# Altium schematic sheet 全联供输出板_V1.0.SchDoc
size A4
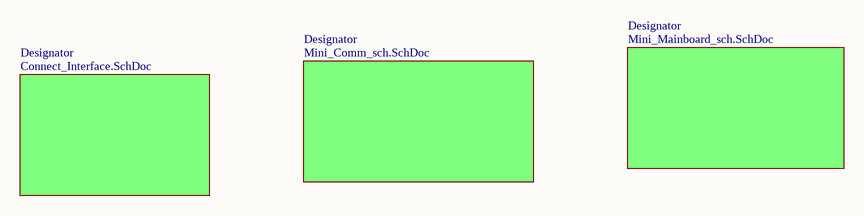
[diagram p0: 全联供输出板_V1.0.SchDoc]

## Sub-sheets
Designator = Connect_Interface.SchDoc: no entries
Designator = Mini_Comm_sch.SchDoc: no entries
Designator = Mini_Mainboard_sch.SchDoc: no entries